# EAGLE schematic houston (EAGLE 7.4.0)
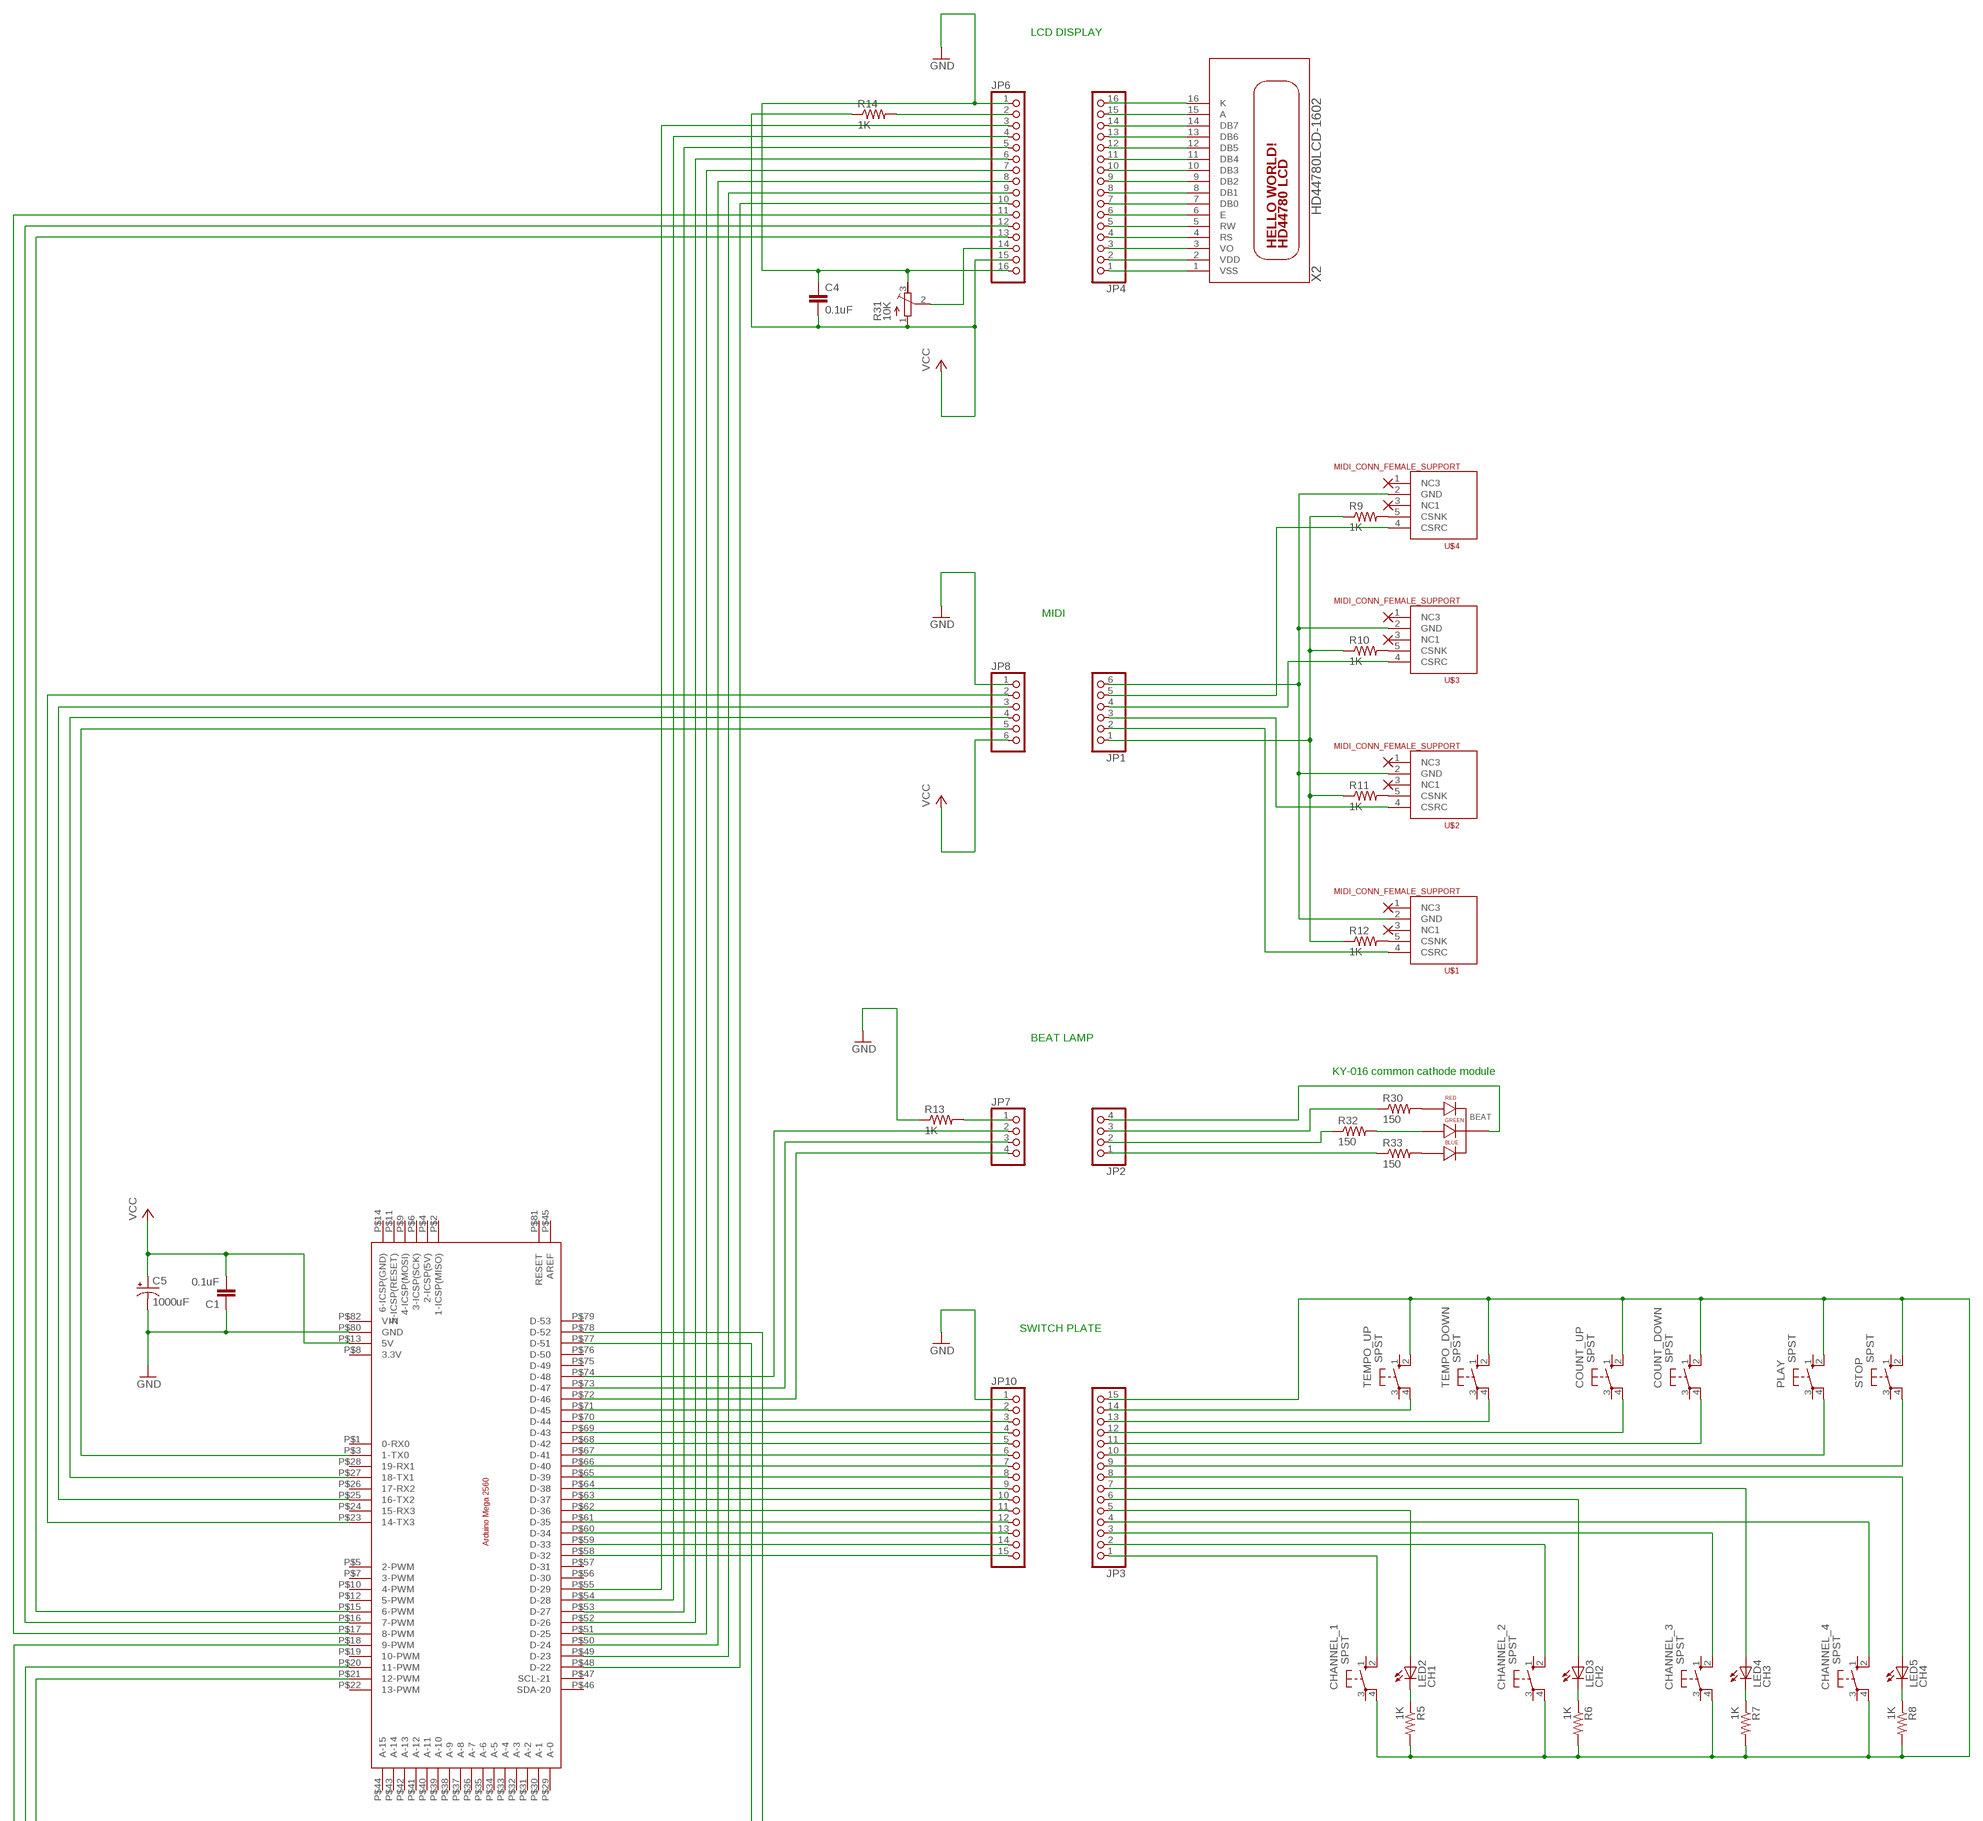
[diagram p0: schematic, sheet 1, part 1 of 3]
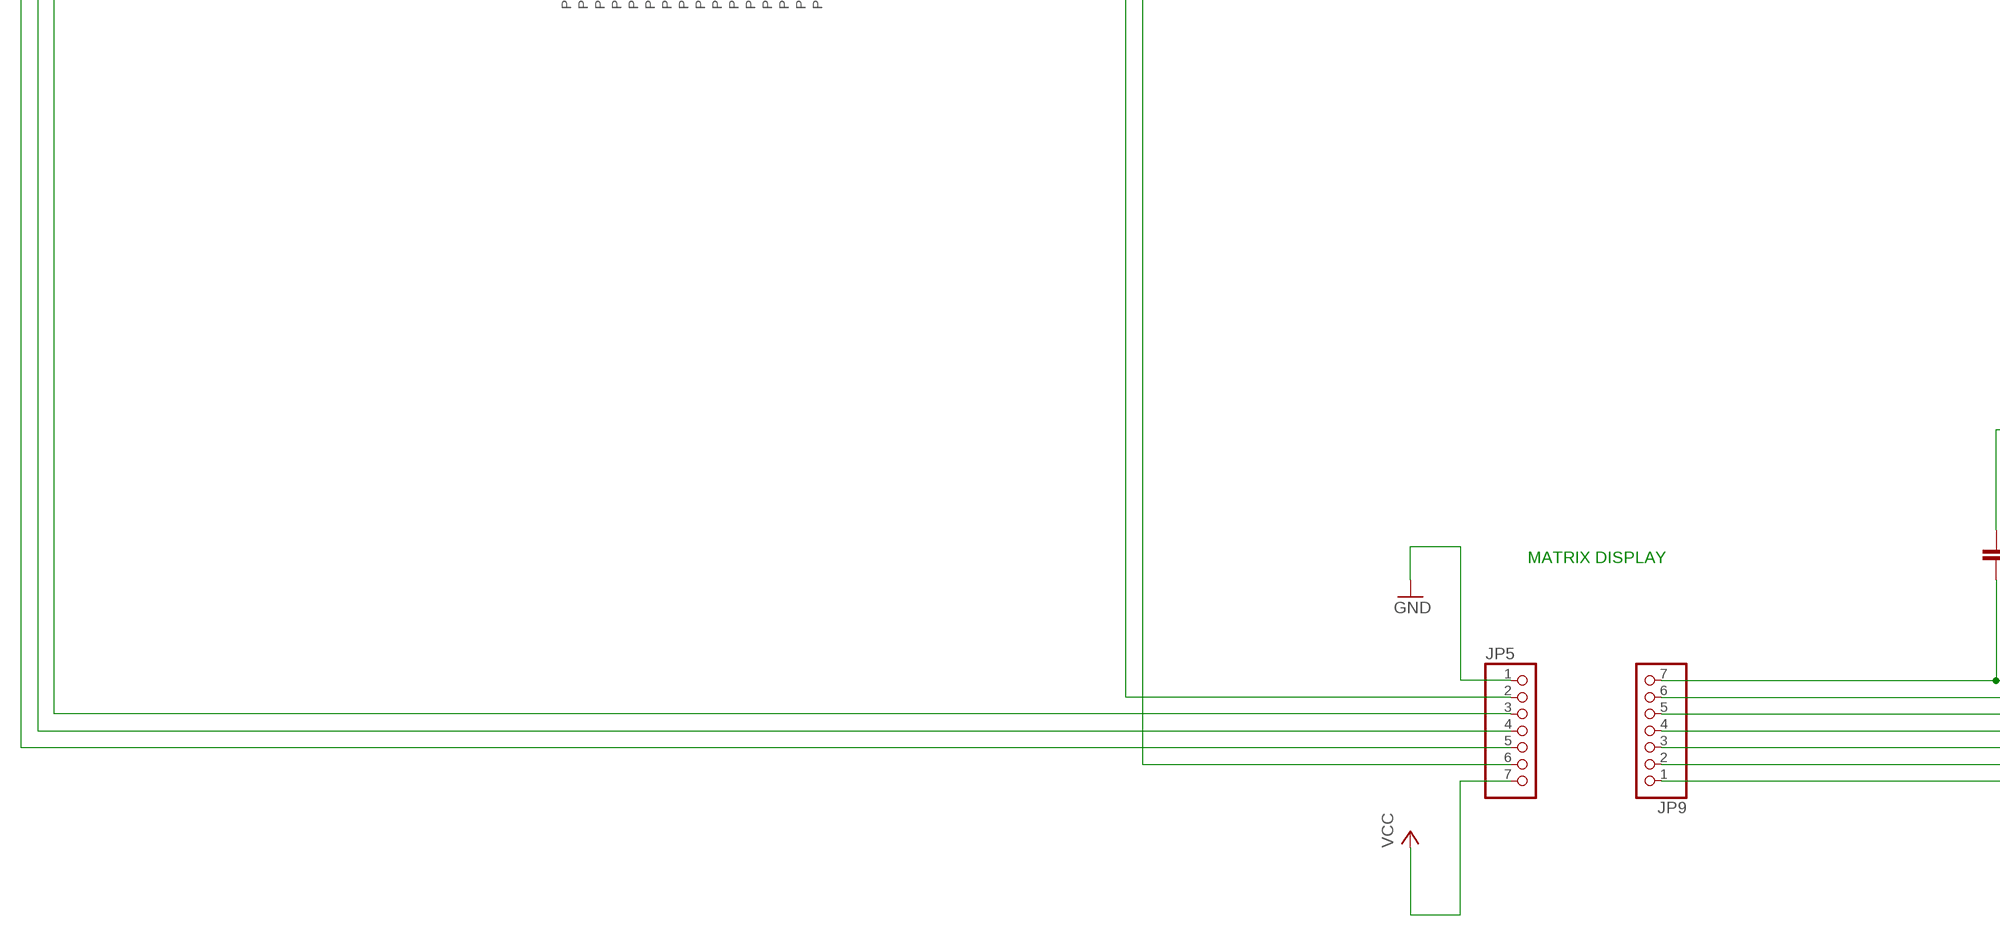
[diagram p1: schematic, sheet 1, part 2 of 3]
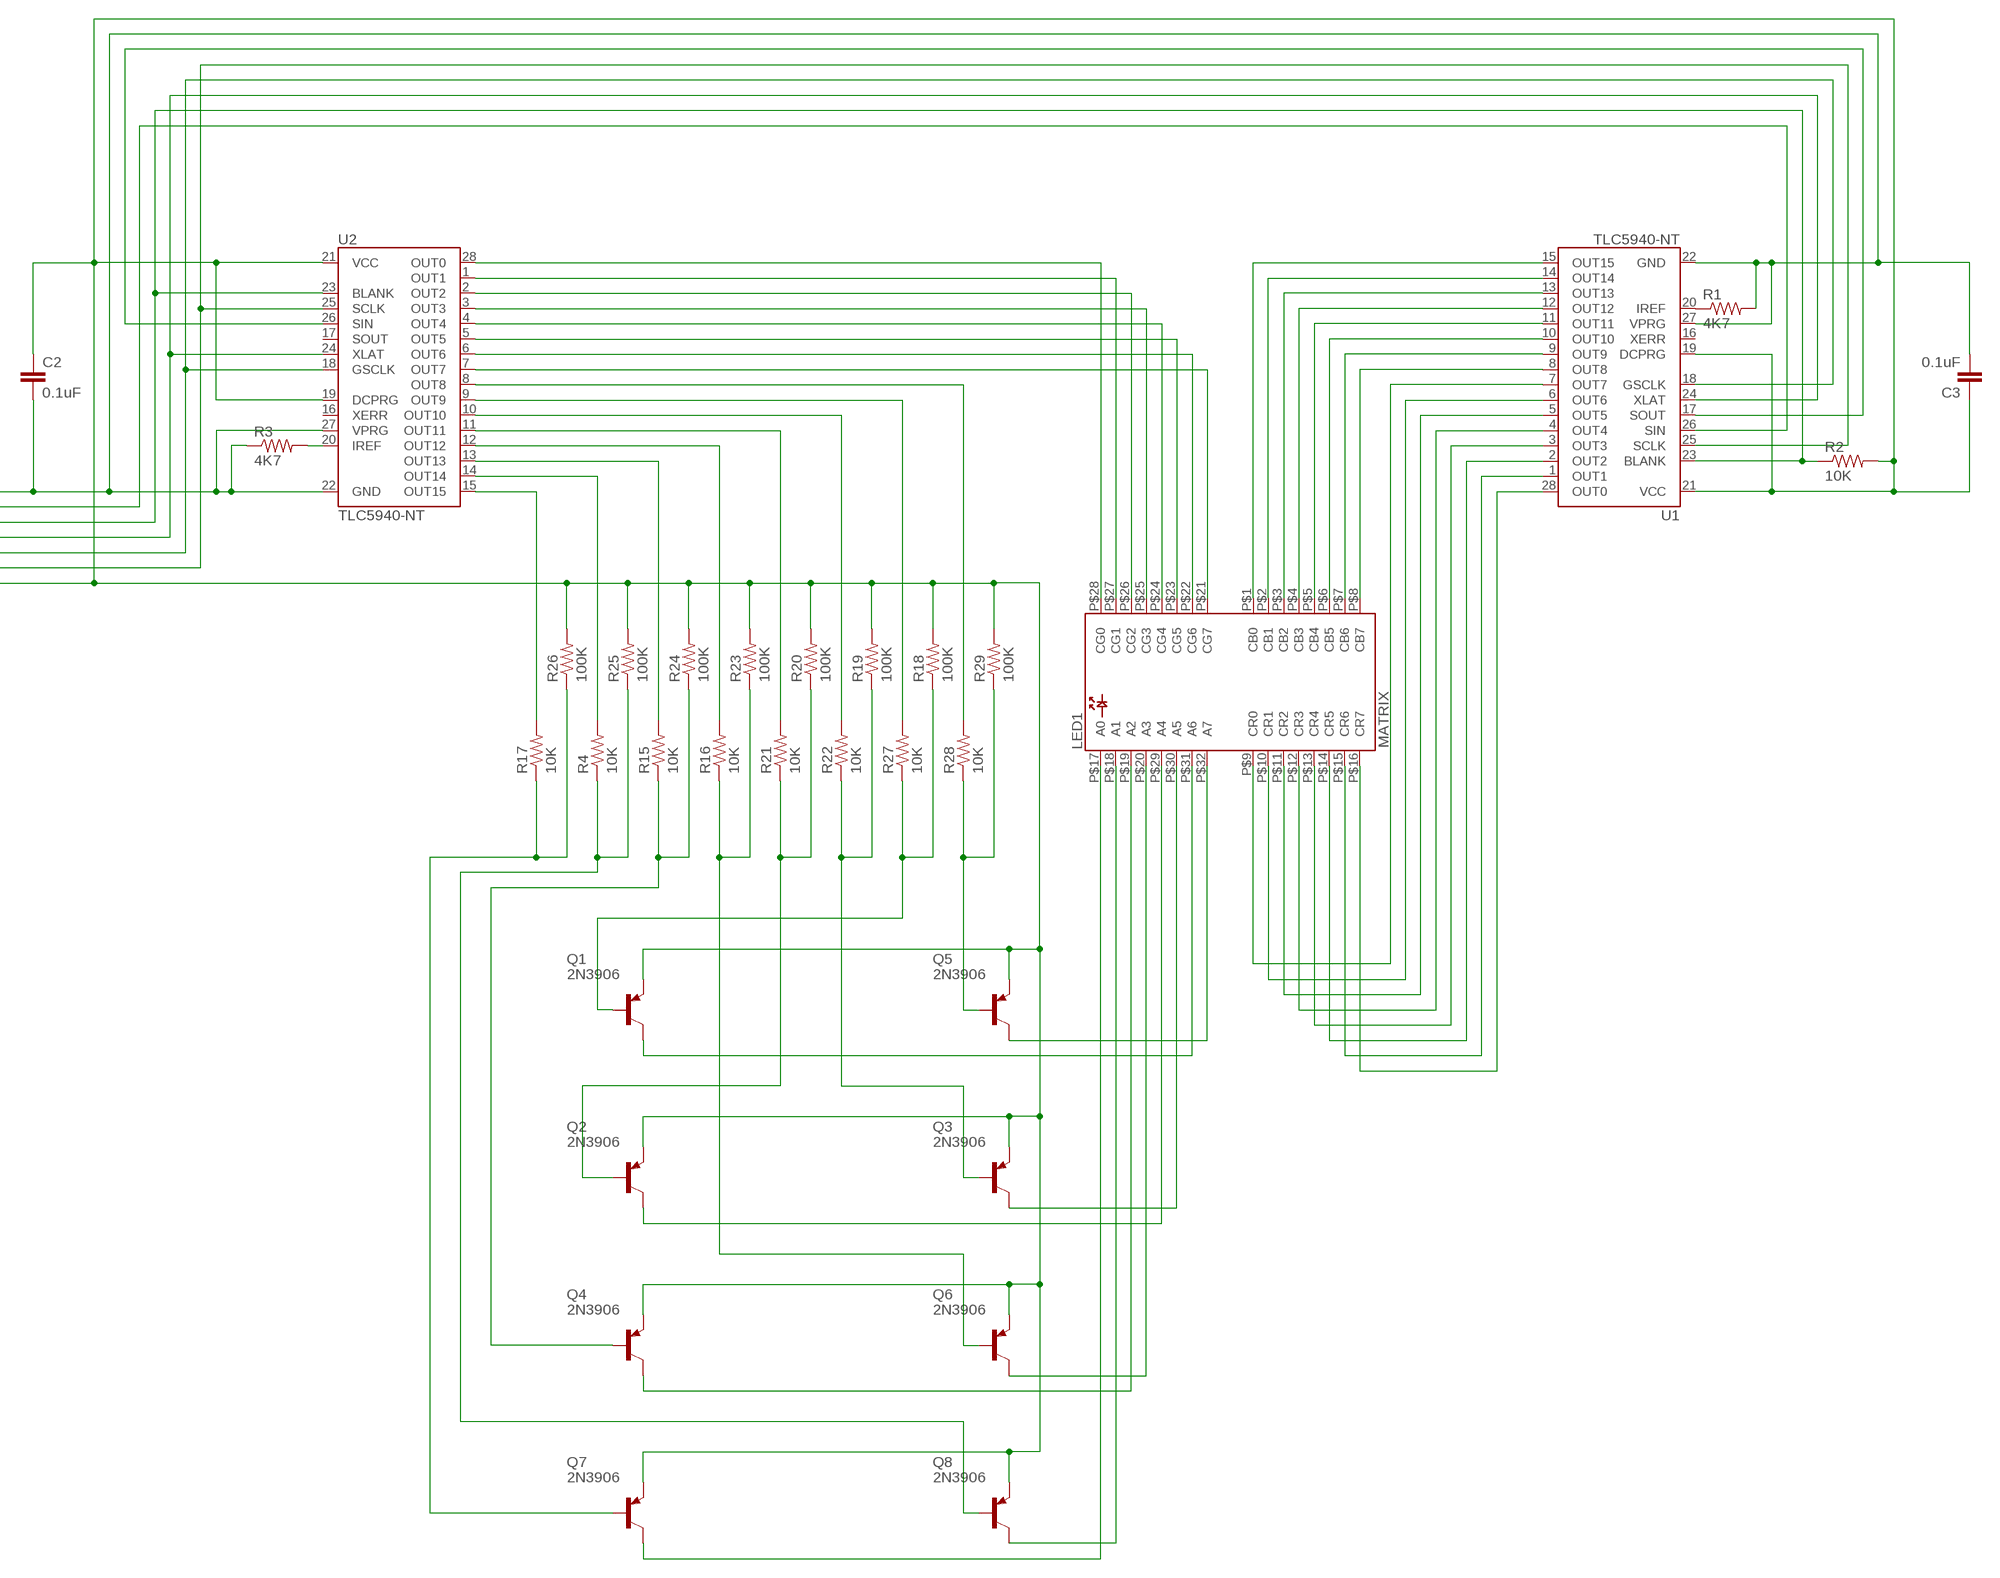
[diagram p2: schematic, sheet 1, part 3 of 3]

## Parts
BEAT  LED-RGB-CC-THRUCLEAR  [LED-RGB-THRU]
C1  0.1uF  CAPEZ  [CAP-PTH-SMALLEZ]
C2  0.1uF  CAPEZ  [CAP-PTH-SMALLEZ]
C3  0.1uF  CAPEZ  [CAP-PTH-SMALLEZ]
C4  0.1uF  CAPEZ  [CAP-PTH-SMALLEZ]
C5  1000uF  CAP_POLPTH4  [CPOL-RADIAL-1000UF-25V]
CHANNEL_1  SPST  40-XX-ROUND  [B3F-40XX-ROUND]
CHANNEL_2  SPST  40-XX-ROUND  [B3F-40XX-ROUND]
CHANNEL_3  SPST  40-XX-ROUND  [B3F-40XX-ROUND]
CHANNEL_4  SPST  40-XX-ROUND  [B3F-40XX-ROUND]
COUNT_DOWN  SPST  40-XX-ROUND  [B3F-40XX-ROUND]
COUNT_UP  SPST  40-XX-ROUND  [B3F-40XX-ROUND]
JP1  PINHD-1X6/90  [1X06/90]
JP2  PINHD-1X4/90  [1X04/90]
JP3  PINHD-1X15/90  [1X15/90]
JP4  PINHD-1X16  [1X16]
JP5  PINHD-1X7  [1X07]
JP6  PINHD-1X16  [1X16]
JP7  PINHD-1X4  [1X04]
JP8  PINHD-1X6  [1X06]
JP9  PINHD-1X7/90  [1X07/90]
JP10  PINHD-1X15-CB  [1X15-CB]
LED1  MATRIX  ORM-2088-RGB-5  [ORM-2088-RGB-5]
LED2  CH1  LED3MM  [LED3MM]
LED3  CH2  LED3MM  [LED3MM]
LED4  CH3  LED3MM  [LED3MM]
LED5  CH4  LED3MM  [LED3MM]
PLAY  SPST  40-XX-ROUND  [B3F-40XX-ROUND]
Q1  2N3906  [TO92]
Q2  2N3906  [TO92]
Q3  2N3906  [TO92]
Q4  2N3906  [TO92]
Q5  2N3906  [TO92]
Q6  2N3906  [TO92]
Q7  2N3906  [TO92]
Q8  2N3906  [TO92]
R1  4K7  R-US_0411/3V  [0411V]
R2  10K  R-US_0411/3V  [0411V]
R3  4K7  R-US_0411/3V  [0411V]
R4  10K  R-US_0207/10  [0207/10]
R5  1K  R-US_0204/7  [0204/7]
R6  1K  R-US_0204/7  [0204/7]
R7  1K  R-US_0204/7  [0204/7]
R8  1K  R-US_0204/7  [0204/7]
R9  1K  R-US_0207/2V  [0207/2V]
R10  1K  R-US_0207/2V  [0207/2V]
R11  1K  R-US_0207/2V  [0207/2V]
R12  1K  R-US_0207/2V  [0207/2V]
R13  1K  R-US_0207/2V  [0207/2V]
R14  1K  R-US_0204/7  [0204/7]
R15  10K  R-US_0207/10  [0207/10]
R16  10K  R-US_0207/10  [0207/10]
R17  10K  R-US_0207/10  [0207/10]
R18  100K  R-US_0207/10  [0207/10]
R19  100K  R-US_0207/10  [0207/10]
R20  100K  R-US_0207/10  [0207/10]
R21  10K  R-US_0207/10  [0207/10]
R22  10K  R-US_0207/10  [0207/10]
R23  100K  R-US_0207/10  [0207/10]
R24  100K  R-US_0207/10  [0207/10]
R25  100K  R-US_0207/10  [0207/10]
R26  100K  R-US_0207/10  [0207/10]
R27  10K  R-US_0207/10  [0207/10]
R28  10K  R-US_0207/10  [0207/10]
R29  100K  R-US_0207/10  [0207/10]
R30  150  R-US_0204/7  [0204/7]
R31  10K  R-TRIMM3296W  [RTRIM3296W]
R32  150  R-US_0204/7  [0204/7]
R33  150  R-US_0204/7  [0204/7]
STOP  SPST  40-XX-ROUND  [B3F-40XX-ROUND]
TEMPO_DOWN  SPST  40-XX-ROUND  [B3F-40XX-ROUND]
TEMPO_UP  SPST  40-XX-ROUND  [B3F-40XX-ROUND]
U1  TLC5940-NT  [DIL28-3]
U2  TLC5940-NT  [DIL28-3]
U$1  MIDI_CONN_FEMALE_SUPPORT  [DIN_5_FEMALE_SUPPORT]
U$2  MIDI_CONN_FEMALE_SUPPORT  [DIN_5_FEMALE_SUPPORT]
U$3  MIDI_CONN_FEMALE_SUPPORT  [DIN_5_FEMALE_SUPPORT]
U$4  MIDI_CONN_FEMALE_SUPPORT  [DIN_5_FEMALE_SUPPORT]
U$6  2560  [MEDUINO2560]
X2  HD44780LCD-1602  [LCD1602]

## Nets
GND: C1.1 C4.1 C5.2(-) JP5.1 JP6.1 JP6.16 JP8.1 JP10.1 R13.1 R31.3(E) U$6.P$80(GND)
N$1: LED2.K(C) R5.1
N$2: LED3.K(C) R6.1
N$3: LED4.K(C) R7.1
N$4: LED5.K(C) R8.1
N$5: JP3.9 STOP.4(P1)
N$6: JP3.10 PLAY.4(P1)
N$7: COUNT_DOWN.4(P1) JP3.11
N$8: CHANNEL_1.2(S1) JP3.1
N$9: CHANNEL_2.2(S1) JP3.2
N$10: CHANNEL_3.2(S1) JP3.3
N$11: CHANNEL_4.2(S1) JP3.4
N$12: JP3.5 LED2.A
N$13: JP3.6 LED3.A
N$14: JP3.7 LED4.A
N$15: JP1.4 U$3.4(CSRC)
N$16: JP1.3 U$2.4(CSRC)
N$17: JP1.2 U$1.4(CSRC)
N$18: R9.2 U$4.5(CSNK)
N$19: R10.2 U$3.5(CSNK)
N$20: R11.2 U$2.5(CSNK)
N$21: R12.2 U$1.5(CSNK)
N$22: JP3.8 LED5.A
N$23: JP1.5 U$4.4(CSRC)
N$24: COUNT_UP.4(P1) JP3.12
N$25: JP3.13 TEMPO_DOWN.4(P1)
N$26: JP3.14 TEMPO_UP.4(P1)
N$27: CHANNEL_1.4(P1) CHANNEL_2.4(P1) CHANNEL_3.4(P1) CHANNEL_4.4(P1) COUNT_DOWN.2(S1) COUNT_UP.2(S1) JP3.15 PLAY.2(S1) R5.2 R6.2 R7.2 R8.2 STOP.2(S1) TEMPO_DOWN.2(S1) TEMPO_UP.2(S1)
N$28: JP1.1 R9.1 R10.1 R11.1 R12.1
N$29: BEAT.1(RED_CATHODE) R30.2
N$30: BEAT.2(CATHODE) JP2.4
N$31: JP2.1 R33.1
N$32: JP2.3 R30.1
N$33: JP7.1 R13.2
N$34: BEAT.3(GREEN_CATHODE) R32.2
N$35: JP1.6 U$1.2(GND) U$2.2(GND) U$3.2(GND) U$4.2(GND)
N$36: BEAT.4(BLUE_CATHODE) R33.2
N$37: JP2.2 R32.1
N$38: LED1.P$1(CB0) U1.15(OUT15)
N$39: LED1.P$2(CB1) U1.14(OUT14)
N$40: JP5.2 U$6.P$77(D-51)
N$41: JP6.10 U$6.P$48(D-22)
N$42: LED1.P$3(CB2) U1.13(OUT13)
N$43: LED1.P$4(CB3) U1.12(OUT12)
N$44: JP6.9 U$6.P$49(D-23)
N$45: JP6.8 U$6.P$50(D-24)
N$46: JP6.2 R14.2
N$47: LED1.P$5(CB4) U1.11(OUT11)
N$48: LED1.P$6(CB5) U1.10(OUT10)
N$49: LED1.P$7(CB6) U1.9(OUT9)
N$50: LED1.P$8(CB7) U1.8(OUT8)
N$51: LED1.P$9(CR0) U1.7(OUT7)
N$52: LED1.P$10(CR1) U1.6(OUT6)
N$53: LED1.P$11(CR2) U1.5(OUT5)
N$54: LED1.P$12(CR3) U1.4(OUT4)
N$55: LED1.P$13(CR4) U1.3(OUT3)
N$56: LED1.P$14(CR5) U1.2(OUT2)
N$57: LED1.P$15(CR6) U1.1(OUT1)
N$58: LED1.P$16(CR7) U1.28(OUT0)
N$59: LED1.P$29(A4) Q2.1(C)
N$60: LED1.P$19(A2) Q4.1(C)
N$61: LED1.P$17(A0) Q7.1(C)
N$62: LED1.P$31(A6) Q1.1(C)
N$63: LED1.P$28(CG0) U2.28(OUT0)
N$64: LED1.P$27(CG1) U2.1(OUT1)
N$65: LED1.P$26(CG2) U2.2(OUT2)
N$66: LED1.P$25(CG3) U2.3(OUT3)
N$67: LED1.P$24(CG4) U2.4(OUT4)
N$68: LED1.P$23(CG5) U2.5(OUT5)
N$69: LED1.P$22(CG6) U2.6(OUT6)
N$70: LED1.P$21(CG7) U2.7(OUT7)
N$71: R28.2 U2.8(OUT8)
N$72: C2.1 C3.1 JP9.1 Q1.3(E) Q2.3(E) Q3.3(E) Q4.3(E) Q5.3(E) Q6.3(E) Q7.3(E) Q8.3(E) R2.2 R18.2 R19.2 R20.2 R23.2 R24.2 R25.2 R26.2 R29.2 U1.19(DCPRG) U1.21(VCC) U2.19(DCPRG) U2.21(VCC)
N$73: U1.17(SOUT) U2.26(SIN)
N$74: R1.1 U1.20(IREF)
N$75: JP9.2 U1.25(SCLK) U2.25(SCLK)
N$76: JP9.3 U1.18(GSCLK) U2.18(GSCLK)
N$77: JP9.4 U1.24(XLAT) U2.24(XLAT)
N$78: JP9.5 R2.1 U1.23(BLANK) U2.23(BLANK)
N$79: JP9.6 U1.26(SIN)
N$80: JP5.6 U$6.P$78(D-52)
N$81: R3.2 U2.20(IREF)
N$82: JP10.15 U$6.P$58(D-32)
N$83: Q3.2(B) R19.1 R22.1
N$84: R27.2 U2.9(OUT9)
N$85: Q5.2(B) R28.1 R29.1
N$86: Q1.2(B) R18.1 R27.1
N$87: LED1.P$18(A1) Q8.1(C)
N$88: JP5.3 U$6.P$21(12-PWM)
N$89: Q6.2(B) R16.1 R23.1
N$90: Q4.2(B) R15.1 R24.1
N$91: C2.2 C3.2 JP9.7 R1.2 R3.1 U1.22(GND) U1.27(VPRG) U2.22(GND) U2.27(VPRG)
N$92: LED1.P$20(A3) Q6.1(C)
N$93: LED1.P$30(A5) Q3.1(C)
N$94: Q7.2(B) R17.1 R26.1
N$95: JP5.4 U$6.P$20(11-PWM)
N$96: Q8.2(B) R4.1 R25.1
N$97: R22.2 U2.10(OUT10)
N$98: R21.2 U2.11(OUT11)
N$99: LED1.P$32(A7) Q5.1(C)
N$100: JP5.5 U$6.P$18(9-PWM)
N$101: R16.2 U2.12(OUT12)
N$102: JP10.14 U$6.P$59(D-33)
N$103: JP6.7 U$6.P$51(D-25)
N$104: JP6.12 U$6.P$16(7-PWM)
N$105: JP6.11 U$6.P$17(8-PWM)
N$106: R15.2 U2.13(OUT13)
N$107: R4.2 U2.14(OUT14)
N$108: R17.2 U2.15(OUT15)
N$109: JP4.16 X2.16(K)
N$110: JP4.15 X2.15(A)
N$111: JP4.14 X2.14(DB7)
N$112: JP4.13 X2.13(DB6)
N$113: JP4.12 X2.12(DB5)
N$114: JP4.11 X2.11(DB4)
N$115: JP4.10 X2.10(DB3)
N$116: JP4.9 X2.9(DB2)
N$117: JP4.8 X2.8(DB1)
N$118: JP4.7 X2.7(DB0)
N$119: JP4.6 X2.6(E)
N$120: JP10.13 U$6.P$60(D-34)
N$121: JP4.5 X2.5(RW)
N$126: Q2.2(B) R20.1 R21.1
N$127: JP10.12 U$6.P$61(D-35)
N$128: JP10.11 U$6.P$62(D-36)
N$129: JP4.4 X2.4(RS)
N$130: JP4.3 X2.3(VO)
N$131: JP6.6 U$6.P$52(D-26)
N$132: JP6.5 U$6.P$53(D-27)
N$133: JP6.4 U$6.P$54(D-28)
N$134: JP10.10 U$6.P$63(D-37)
N$135: JP6.3 U$6.P$55(D-29)
N$136: JP6.13 U$6.P$15(6-PWM)
N$137: JP10.9 U$6.P$64(D-38)
N$139: JP10.8 U$6.P$65(D-39)
N$140: JP10.7 U$6.P$66(D-40)
N$141: JP10.6 U$6.P$67(D-41)
N$142: JP10.5 U$6.P$68(D-42)
N$143: JP10.4 U$6.P$69(D-43)
N$144: JP10.3 U$6.P$70(D-44)
N$145: JP10.2 U$6.P$71(D-45)
N$146: JP7.4 U$6.P$72(D-46)
N$147: JP7.3 U$6.P$73(D-47)
N$148: JP7.2 U$6.P$74(D-48)
N$149: JP8.5 U$6.P$3(1-TX0)
N$150: JP8.4 U$6.P$27(18-TX1)
N$151: JP8.3 U$6.P$25(16-TX2)
N$152: JP8.2 U$6.P$23(14-TX3)
N$153: JP6.14 R31.2(S)
VCC: C1.2 C4.2 C5.1(+) JP5.7 JP6.15 JP8.6 R14.1 R31.1(A) U$6.P$13(5V)
VDD: JP4.2 X2.2(VDD)
VSS: JP4.1 X2.1(VSS)
Unconnected: CHANNEL_1.1(S) CHANNEL_1.3(P) CHANNEL_2.1(S) CHANNEL_2.3(P) CHANNEL_3.1(S) CHANNEL_3.3(P) CHANNEL_4.1(S) CHANNEL_4.3(P) COUNT_DOWN.1(S) COUNT_DOWN.3(P) COUNT_UP.1(S) COUNT_UP.3(P) PLAY.1(S) PLAY.3(P) STOP.1(S) STOP.3(P) TEMPO_DOWN.1(S) TEMPO_DOWN.3(P) TEMPO_UP.1(S) TEMPO_UP.3(P) U1.16(XERR) U2.16(XERR) U2.17(SOUT) U$1.1(NC3) U$1.3(NC1) U$2.1(NC3) U$2.3(NC1) U$3.1(NC3) U$3.3(NC1) U$4.1(NC3) U$4.3(NC1) U$6.P$1(0-RX0) U$6.P$2(1-ICSP(MISO)) U$6.P$4(2-ICSP(5V)) U$6.P$5(2-PWM) U$6.P$6(3-ICSP(SCK)) U$6.P$7(3-PWM) U$6.P$8(3.3V) U$6.P$9(4-ICSP(MOSI)) U$6.P$10(4-PWM) U$6.P$11(5-ICSP(RESET)) U$6.P$12(5-PWM) U$6.P$14(6-ICSP(GND)) U$6.P$19(10-PWM) U$6.P$22(13-PWM) U$6.P$24(15-RX3) U$6.P$26(17-RX2) U$6.P$28(19-RX1) U$6.P$29(A-0) U$6.P$30(A-1) U$6.P$31(A-2) U$6.P$32(A-3) U$6.P$33(A-4) U$6.P$34(A-5) U$6.P$35(A-6) U$6.P$36(A-7) U$6.P$37(A-8) U$6.P$38(A-9) U$6.P$39(A-10) U$6.P$40(A-11) U$6.P$41(A-12) U$6.P$42(A-13) U$6.P$43(A-14) U$6.P$44(A-15) U$6.P$45(AREF) U$6.P$46(SDA-20) U$6.P$47(SCL-21) U$6.P$56(D-30) U$6.P$57(D-31) U$6.P$75(D-49) U$6.P$76(D-50) U$6.P$79(D-53) U$6.P$81(RESET) U$6.P$82(VIN)

## Notes on the sheet
- LCD DISPLAY
- MIDI
- BEAT LAMP
- KY-016 common cathode module
- SWITCH PLATE
- MATRIX DISPLAY

## Library data of the parts
BEAT = SparkFun-LED:LED-RGB-CC-THRU: RGB Through-hole common cathode LED SparkFun Storefront: COM-00105 (Clear) COM-09264 (Diffuse); PROD_ID: DIO-08418
C1-C4 = SparkFun-Capacitors:CAP: Capacitor Standard 0603 ceramic capacitor, and 0.1" leaded capacitor.
C5 = SparkFun-Passives:CAP_POL: Capacitor Polarized These are standard SMD and PTH capacitors. Normally 10uF, 47uF, and 100uF in electrolytic and tantalum varieties. Always verify the external diameter of the through hole cap, it varies with capacity, voltage, and manufacturer. The EIA devices should be standard.
CHANNEL_1-CHANNEL_4 COUNT_DOWN COUNT_UP PLAY STOP TEMPO_DOWN TEMPO_UP = adafruit:40-XX: OMRON SWITCH
JP1 = pinhead:PINHD-1X6: PIN HEADER
JP2 JP7 = pinhead:PINHD-1X4: PIN HEADER
JP3 = pinhead:PINHD-1X15: PIN HEADER
JP4 JP6 = pinhead:PINHD-1X16: PIN HEADER
JP5 JP9 = pinhead:PINHD-1X7: PIN HEADER
JP8 = adafruit:PINHD-1X6: PIN HEADER
JP10 = adafruit:PINHD-1X15: PIN HEADER
LED1 = LED (2):ORM-2088-RGB-5: ORM 2088RGB-5 8x8 LED RGB Matrix
LED2-LED5 = adafruit:LED: LED OSRAM: - CHIPLED LG R971, LG N971, LY N971, LG Q971, LY Q971, LO R971, LY R971 LH N974, LH R974 LS Q976, LO Q976, LY Q976 LO Q996 - Hyper CHIPLED LW Q18S LB Q993, LB Q99A, LB R99A - SideLED LS A670, LO A670, LY A670, LG A670, LP A670 LB A673, LV A673, LT A673, LW A673 LH A674 LY A675 LS A676, LA A676, LO A676, LY A676, LW A676 LS A679, LY A679, LG A679 - Hyper Micro SIDELED® LS Y876, LA Y876, LO Y876, LY Y876 LT Y87S - SmartLED LW L88C, LW L88S LB L89C, LB L89S, LG L890 LS L89K, LO L89K, LY L89K LS L896, LA L896, LO L896, LY L896 - TOPLED LS T670, LO T670, LY T670, LG T670, LP T670 LSG T670, LSP T670, LSY T670, LOP T670, LYG T670 LG T671, LOG T671, LSG T671 LB T673, LV T673, LT T673, LW T673 LH T674 LS T676, LA T676, LO T676, LY T676, LB T676, LH T676, LSB T676, LW T676 LB T67C, LV T67C, LT T67C, LS T67K, LO T67K, LY T67K, LW E67C LS E67B, LA E67B, LO E67B, LY E67B, LB E67C, LV E67C, LT E67C LW T67C LS T679, LY T679, LG T679 LS T770, LO T770, LY T770, LG T770, LP T770 LB T773, LV T773, LT T773, LW T773 LH T774 LS E675, LA E675, LY E675, LS T675 LS T776, LA T776, LO T776, LY T776, LB T776 LHGB T686 LT T68C, LB T68C - Hyper Mini TOPLED® LB M676 - Mini TOPLED Santana® LG M470 LS M47K, LO M47K, LY M47K Source: http://www.osram.convergy.de/
Q1-Q8 = transistor-pnp:2N3906: PNP Transistor
R1-R3 R30 R32 R33 = adafruit:R-US_: RESISTOR, American symbol
R4-R13 R15-R29 = resistor:R-US_: RESISTOR, American symbol
R14 = rcl:R-US_: RESISTOR, American symbol
R31 = resistor:R-TRIMM: Trimm resistor
U1 U2 = SparkFun-DigitalIC:TLC5940: 16-channel LED Driver with Dot Correction and Grayscale PWM Control The TLC5940 is a 16-channel, constant-current sink LED driver. Each channel has an individually adjustable 4096-step grayscale PWM brightness control and a 64-step, constant-current sink (dot correction). The dot correction adjusts the brightness variations between LED channels and other LED drivers. The dot correction data is stored in an integrated EEPROM. Both grayscale control and dot correction are accessible via a serial interface. A single external resistor sets the maximum current value of all 16 channels. Packages: 28-pin HTSSOP 32-pin 5x5mm QFN 28-pin DIP
U$1-U$4 = SparkFun-Connectors:MIDI_CONN_FEMALE_SUPPORT: MIDI connector with strain relief (DIN-5 female)
U$6 = meduino2560:2560: Meduino 2560 PCB
X2 = adafruit:HD44780LCD: HD44780 LCD Standard character type LCDs, available in sizes from 8x1 to 40x4!